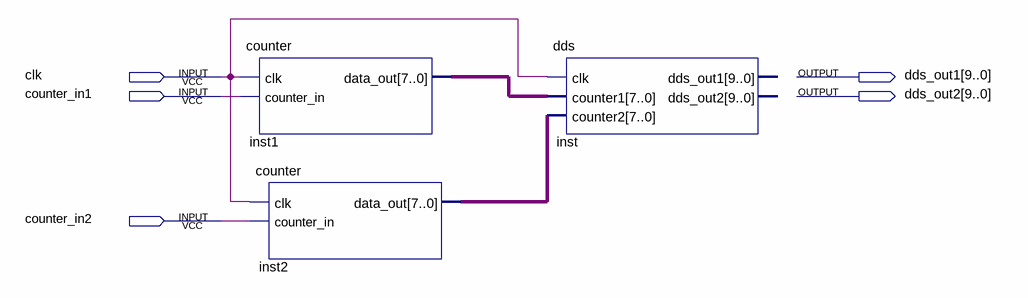
[diagram p0: schematic sheet]
// Quartus schematic dds1.bdf as structural Verilog: 3 symbols, 5 pins
module dds1 (
  input  clk,
  input  counter_in1,
  input  counter_in2,
  output [9:0] dds_out1,
  output [9:0] dds_out2
);

  wire [7:0] inst1_data_out, inst2_data_out;

  counter inst1 (.clk(clk), .counter_in(counter_in1), .data_out(inst1_data_out));
  counter inst2 (.clk(clk), .counter_in(counter_in2), .data_out(inst2_data_out));
  dds inst (.clk(clk), .counter1(inst1_data_out), .counter2(inst2_data_out));  // open: dds_out1, dds_out2
endmodule
